# Altium schematic sheet ESD_PROTECTION.SchDoc
size A; SheetNumber: 9; SheetTotal: 9
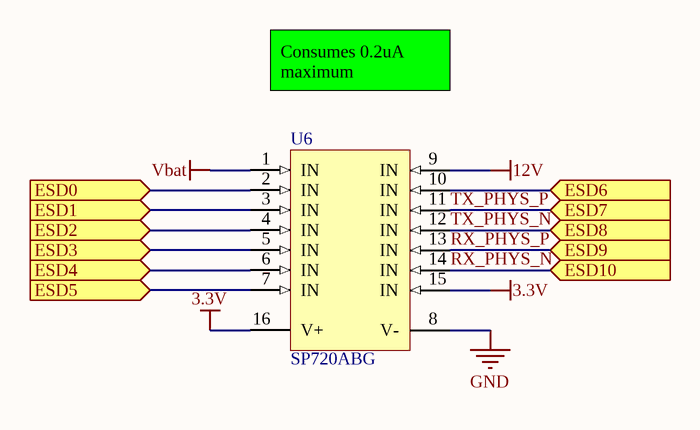
[diagram p0: ESD_PROTECTION.SchDoc]

## Parts
U6  SP720ABG  [LFUS-SOIC-16_L]

## Ports
ESD0 (in), ESD1 (in), ESD2 (in), ESD3 (in), ESD4 (in), ESD5 (in), ESD6 (in), ESD7 (in), ESD8 (in), ESD9 (in), ESD10 (in)

## Nets
3.3V: U6.15(IN) U6.16(V+)
12V: U6.9(IN)
GND: U6.8(V-)
Vbat: U6.1(IN)
ESD0: U6.2(IN) ; port ESD0
ESD1: U6.3(IN) ; port ESD1
ESD2: U6.4(IN) ; port ESD2
ESD3: U6.5(IN) ; port ESD3
ESD4: U6.6(IN) ; port ESD4
ESD5: U6.7(IN) ; port ESD5
ESD6: U6.10(IN) ; port ESD6
RX_PHYS_N: U6.14(IN) ; port ESD10
RX_PHYS_P: U6.13(IN) ; port ESD9
TX_PHYS_N: U6.12(IN) ; port ESD8
TX_PHYS_P: U6.11(IN) ; port ESD7

## Notes on the sheet
- Consumes 0.2uA maximum

## Library data of the parts
U6 = CMP-2000-07137-1: Electronic Protection Array for ESD and Overvoltage Protection, 3 pF, -40 to 105 degC, 16-Pin SOIC, RoHS, Tube; Manufacturer: Littelfuse; Other Names: F2717; Online Catalog: SPA™SP72xSeries; Voltage - Working: 30V; Product Training Modules: TVSDiodeArrays-ESDSuppressorsforI/OInterfaces; Number of Circuits: 14; Catalog Drawings: SP72SeriesCircuit; Datasheet URL: https://datasheet.ciiva.com/1219/sp720-leadfree-1219859.pdf; Standard Package: 1,920; Technology: MixedTechnology; Package Description: 16-Pin Small Outline Integrated Circuit, Body 9.9 x 3.9 mm, Pitch 1.27 mm; Family: TVS-MixedTechnology; Applications: GeneralPurpose; Datasheet Version: 01/2006; Package / Case: 16-SOIC(0.154",3.90mmWidth); Manufacturer URL: http://www.littelfuse.com/; Series: -; Voltage - Clamping: -; Supplier Device Package: 16-SOIC; Mounting Technology: SurfaceMount; Power (Watts): -; Category: CircuitProtection; Package Reference: SOIC-16; Packaging: Tube